# Altium schematic sheet DRAM.SchDoc
size A; SheetNumber: 7; SheetTotal: 7
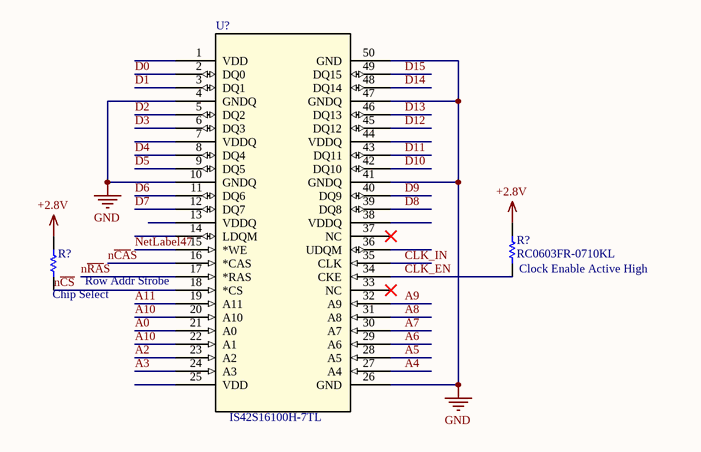
[diagram p0: DRAM.SchDoc]

## Parts
(Parts that share a designator on the sheet are numbered #1, #2 ... from top to bottom, then left to right.)
R?#1  RC0603FR-0710KL  [RESC1608X55X25ML10T15]
R?#2  RC0603FR-0710KL  [RESC1608X55X25ML10T15]  (value not drawn)
U?  IS42S16100H-7TL  [TSOPII_50L_400MIL_ISI]

## Nets
+2.8V: R?#1.2 R?#2.2
GND: U?.4(GNDQ) U?.10(GNDQ) U?.26(GND) U?.41(GNDQ) U?.47(GNDQ) U?.50(GND)
A0: U?.21(A0)
A2: U?.23(A2)
A3: U?.24(A3)
A4: U?.27(A4)
A5: U?.28(A5)
A6: U?.29(A6)
A7: U?.30(A7)
A8: U?.31(A8)
A9: U?.32(A9)
A10: U?.20(A10) U?.22(A1)
A11: U?.19(A11)
CLK_EN: R?#1.1 U?.34(CKE)
CLK_IN: U?.35(CLK)
D0: U?.2(DQ0)
D1: U?.3(DQ1)
D2: U?.5(DQ2)
D3: U?.6(DQ3)
D4: U?.8(DQ4)
D5: U?.9(DQ5)
D6: U?.11(DQ6)
D7: U?.12(DQ7)
D8: U?.39(DQ8)
D9: U?.40(DQ9)
D10: U?.42(DQ10)
D11: U?.43(DQ11)
D12: U?.45(DQ12)
D13: U?.46(DQ13)
D14: U?.48(DQ14)
D15: U?.49(DQ15)
n~{CA}S: U?.16(*CAS)
n~{CS}: R?#2.1 U?.18(*CS)
NetLabel47: U?.15(*WE)
n~{RA}S: U?.17(*RAS)

Not connected (* = marked no-connect by the designer): U? 1(VDD) 7(VDDQ) 13(VDDQ) 14(LDQM) 25(VDD) 33(NC)* 36(UDQM) 37(NC)* 38(VDDQ) 44(VDDQ)

## Notes on the sheet
- (near R?#2) Chip Select
- Row Addr Strobe
- (near R?#1) Clock Enable Active High

## Library data of the parts
R?#1 R?#2 = CMP-2100-03664-1: Chip Resistor, 10 KOhm, +/- 1%, 01 W, -55 to 155 degC, 0603 (1608 Metric), RoHS, Tape and Reel; Manufacturer: Yageo; Temperature Coefficient: 100ppm/degreesC; Resistance: 10KOhm; Voltage Rating: 75V; Power Rating: 100mW; Voltage Rating (DC): 50V; Composition: ThickFilm; RoHSCompliant: true; Height: 0.45mm; Lead Free: LeadFree; Case Code (Metric): 1608; Case/Package: 0603; Datasheet Version: Rev. 5, 10/2016; Package Reference: 0603; Depth: 0.8mm; Package Description: 2-Pin Surface Mount Device, Body 1.6 x 0.8 mm; Case Code (Imperial): 0603; Packaging: TapeandReel; Termination: SMD/SMT; Lead Pitch: 0.3mm; Width: 0.8mm; Number of Pins: 2; Length: 1.6mm; REACH SVHC: NoSVHC; Military Standard: Not; Max Operating Temperature: 155degC; Min Operating Temperature: -55degC; Manufacturer URL: http://www.yageo.com/; Datasheet URL: http://www.yageo.com/NewPortal/yageodocoutput?fileName=/pdf/R-Chip/PYu-RC_Group_51_RoHS_L_5.pdf; Weight: 7.1E-05oz; Tolerance: 1%
U? = IS42S16100H-7TL: No Description Available; Vendor: ISSI; Built_By: EMA_Cory; SourceLibrary: ISSI_2020-05-21; Datasheet: http://www.issi.com/WW/pdf/42-45S16100H.pdf; Manufacturer_Part_Number: IS42S16100H-7TL; Copyright: Copyright (C) 2018 Accelerated Designs. All rights reserved; RefDes: RefDes; Type: DEV